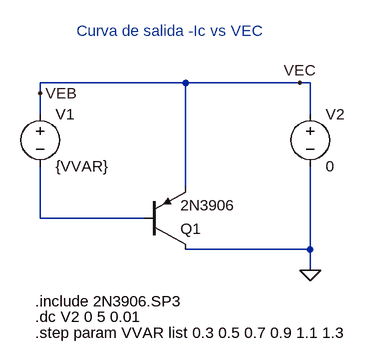
[diagram p0: schematic sim_bjt_output.asc]
sim_bjt_output.asc, the LTspice schematic file:
Version 4
SHEET 1 880 680
WIRE 304 64 80 64
WIRE 480 64 304 64
WIRE 496 64 480 64
WIRE 80 80 80 64
WIRE 80 112 80 80
WIRE 496 112 496 64
WIRE 304 224 304 64
WIRE 80 272 80 192
WIRE 240 272 80 272
WIRE 496 320 496 192
WIRE 496 320 304 320
WIRE 496 352 496 320
FLAG 496 352 0
FLAG 80 80 VEB
FLAG 480 64 VEC
SYMBOL voltage 80 96 R0
SYMATTR InstName V1
SYMATTR Value {VVAR}
SYMBOL voltage 496 96 R0
SYMATTR InstName V2
SYMATTR Value 0
SYMBOL pnp 240 320 M180
SYMATTR InstName Q1
SYMATTR Value 2N3906
TEXT 72 400 Left 2 !.include 2N3906.SP3
TEXT 72 424 Left 2 !.dc V2 0 5 0.01
TEXT 72 448 Left 2 !.step param VVAR list 0.3 0.5 0.7 0.9 1.1 1.3
TEXT 136 -16 Left 2 ;Curva de salida -Ic vs VEC

The netlist it stands for:
* sim_bjt_output.asc
V1 VEC N001 {VVAR}
V2 VEC 0 0
Q1 0 N001 VEC 0 2N3906
.model NPN NPN
.model PNP PNP
.lib standard.bjt
.include 2N3906.SP3
.dc V2 0 5 0.01
.step param VVAR list 0.3 0.5 0.7 0.9 1.1 1.3
* Curva de salida -Ic vs VEC
.backanno
.end